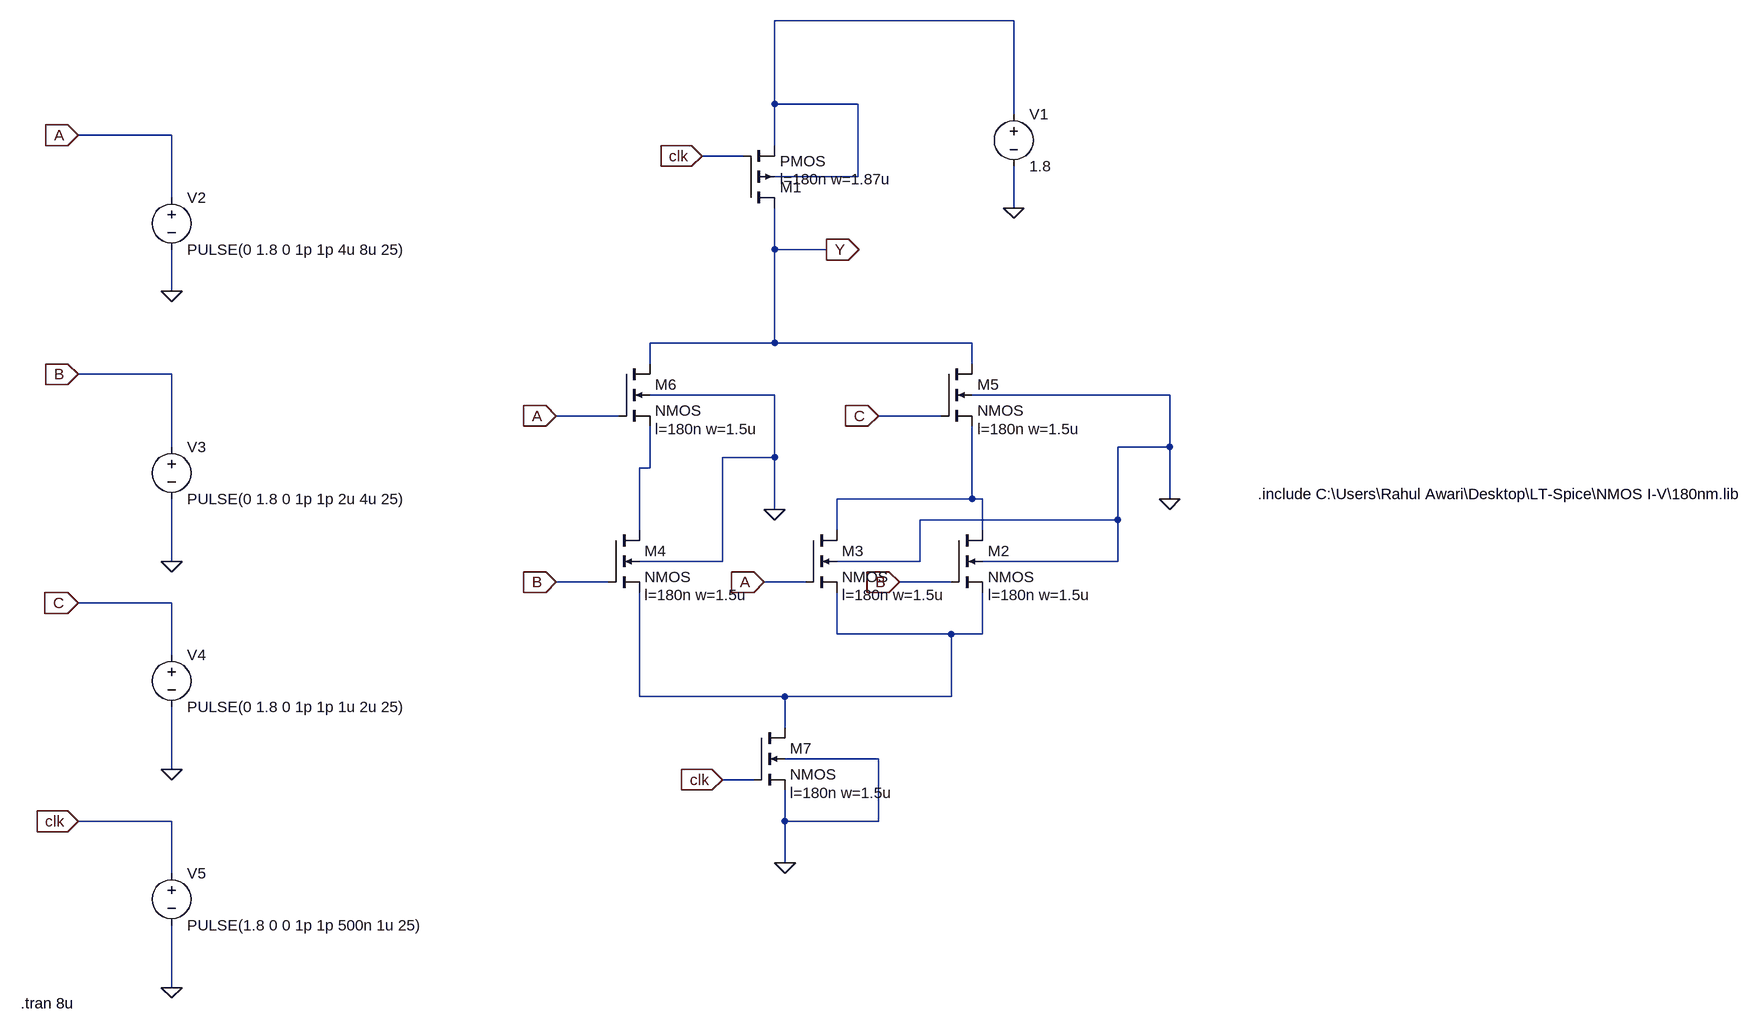
[diagram p0: schematic task5.asc]
task5.asc, the LTspice schematic file:
Version 4
SHEET 1 1788 1400
WIRE 576 -128 208 -128
WIRE 208 0 208 -128
WIRE 336 0 208 0
WIRE 576 16 576 -128
WIRE -720 48 -864 48
WIRE 208 64 208 0
WIRE 160 80 96 80
WIRE 336 112 336 0
WIRE 336 112 208 112
WIRE -720 144 -720 48
WIRE 576 160 576 96
WIRE 208 224 208 160
WIRE 288 224 208 224
WIRE -720 288 -720 224
WIRE 208 368 208 224
WIRE 208 368 16 368
WIRE 512 368 208 368
WIRE 16 400 16 368
WIRE 512 400 512 368
WIRE -720 416 -864 416
WIRE 208 448 16 448
WIRE 816 448 512 448
WIRE -32 480 -128 480
WIRE 464 480 368 480
WIRE -720 528 -720 416
WIRE 816 528 816 448
WIRE 816 528 736 528
WIRE 208 544 208 448
WIRE 208 544 128 544
WIRE 16 560 16 496
WIRE 16 560 0 560
WIRE 512 608 512 496
WIRE 512 608 304 608
WIRE 528 608 512 608
WIRE 816 608 816 528
WIRE 208 624 208 544
WIRE 736 640 736 528
WIRE 736 640 432 640
WIRE 0 656 0 560
WIRE 304 656 304 608
WIRE 528 656 528 608
WIRE -720 704 -720 608
WIRE 128 704 128 544
WIRE 128 704 0 704
WIRE 432 704 432 640
WIRE 432 704 304 704
WIRE 736 704 736 640
WIRE 736 704 528 704
WIRE -48 736 -128 736
WIRE 256 736 192 736
WIRE 480 736 400 736
WIRE -720 768 -864 768
WIRE 304 816 304 752
WIRE 480 816 304 816
WIRE 528 816 528 752
WIRE 528 816 480 816
WIRE -720 848 -720 768
WIRE 0 912 0 752
WIRE 224 912 0 912
WIRE 480 912 480 816
WIRE 480 912 224 912
WIRE 224 960 224 912
WIRE 368 1008 224 1008
WIRE -720 1024 -720 928
WIRE 176 1040 128 1040
WIRE -720 1104 -864 1104
WIRE 224 1104 224 1056
WIRE 368 1104 368 1008
WIRE 368 1104 224 1104
WIRE 224 1168 224 1104
WIRE -720 1184 -720 1104
WIRE -720 1360 -720 1264
FLAG 576 160 0
FLAG 96 80 clk
IOPIN 96 80 In
FLAG 288 224 Y
IOPIN 288 224 Out
FLAG 224 1168 0
FLAG -128 480 A
IOPIN -128 480 In
FLAG 368 480 C
IOPIN 368 480 In
FLAG -128 736 B
IOPIN -128 736 In
FLAG 400 736 B
IOPIN 400 736 In
FLAG 192 736 A
IOPIN 192 736 In
FLAG 128 1040 clk
IOPIN 128 1040 In
FLAG -720 288 0
FLAG -720 704 0
FLAG -720 1024 0
FLAG -720 1360 0
FLAG -864 48 A
IOPIN -864 48 In
FLAG -864 416 B
IOPIN -864 416 In
FLAG -864 768 C
IOPIN -864 768 In
FLAG -864 1104 clk
IOPIN -864 1104 In
FLAG 208 624 0
FLAG 816 608 0
SYMBOL pmos4 160 160 M180
WINDOW 123 56 44 Left 2
SYMATTR Value2 l=180n w=1.87u
SYMATTR InstName M1
SYMBOL voltage 576 0 R0
WINDOW 123 0 0 Left 0
WINDOW 39 0 0 Left 0
SYMATTR InstName V1
SYMATTR Value 1.8
SYMBOL nmos4 480 656 R0
WINDOW 123 56 100 Left 2
SYMATTR Value2 l=180n w=1.5u
SYMATTR InstName M2
SYMBOL nmos4 256 656 R0
WINDOW 123 56 100 Left 2
SYMATTR Value2 l=180n w=1.5u
SYMATTR InstName M3
SYMBOL nmos4 -48 656 R0
WINDOW 123 56 100 Left 2
SYMATTR Value2 l=180n w=1.5u
SYMATTR InstName M4
SYMBOL nmos4 464 400 R0
WINDOW 123 56 100 Left 2
SYMATTR Value2 l=180n w=1.5u
SYMATTR InstName M5
SYMBOL nmos4 -32 400 R0
WINDOW 123 56 100 Left 2
SYMATTR Value2 l=180n w=1.5u
SYMATTR InstName M6
SYMBOL nmos4 176 960 R0
WINDOW 123 56 100 Left 2
SYMATTR Value2 l=180n w=1.5u
SYMATTR InstName M7
SYMBOL voltage -720 128 R0
WINDOW 123 0 0 Left 0
WINDOW 39 0 0 Left 0
SYMATTR InstName V2
SYMATTR Value PULSE(0 1.8 0 1p 1p 4u 8u 25)
SYMBOL voltage -720 512 R0
WINDOW 123 0 0 Left 0
WINDOW 39 0 0 Left 0
SYMATTR InstName V3
SYMATTR Value PULSE(0 1.8 0 1p 1p 2u 4u 25)
SYMBOL voltage -720 832 R0
WINDOW 123 0 0 Left 0
WINDOW 39 0 0 Left 0
SYMATTR InstName V4
SYMATTR Value PULSE(0 1.8 0 1p 1p 1u 2u 25)
SYMBOL voltage -720 1168 R0
WINDOW 123 0 0 Left 0
WINDOW 39 0 0 Left 0
SYMATTR InstName V5
SYMATTR Value PULSE(1.8 0 0 1p 1p 500n 1u 25)
TEXT 952 600 Left 2 !.include C:\\Users\\Rahul Awari\\Desktop\\LT-Spice\\NMOS I-V\\180nm.lib
TEXT -952 1384 Left 2 !.tran 8u

The netlist it stands for:
* task5.asc
M1 Y clk N001 N001 PMOS l=180n w=1.87u
V1 N001 0 1.8
M2 N003 B N004 0 NMOS l=180n w=1.5u
M3 N003 A N004 0 NMOS l=180n w=1.5u
M4 N002 B N004 0 NMOS l=180n w=1.5u
M5 Y C N003 0 NMOS l=180n w=1.5u
M6 Y A N002 0 NMOS l=180n w=1.5u
M7 N004 clk 0 0 NMOS l=180n w=1.5u
V2 A 0 PULSE(0 1.8 0 1p 1p 4u 8u 25)
V3 B 0 PULSE(0 1.8 0 1p 1p 2u 4u 25)
V4 C 0 PULSE(0 1.8 0 1p 1p 1u 2u 25)
V5 clk 0 PULSE(1.8 0 0 1p 1p 500n 1u 25)
.model NMOS NMOS
.model PMOS PMOS
.lib standard.mos
.include C:\Users\Rahul Awari\Desktop\LT-Spice\NMOS I-V\180nm.lib
.tran 8u
.backanno
.end